# EAGLE schematic schema_v1 (EAGLE 7.7.0)

## Sheet 1 of 2
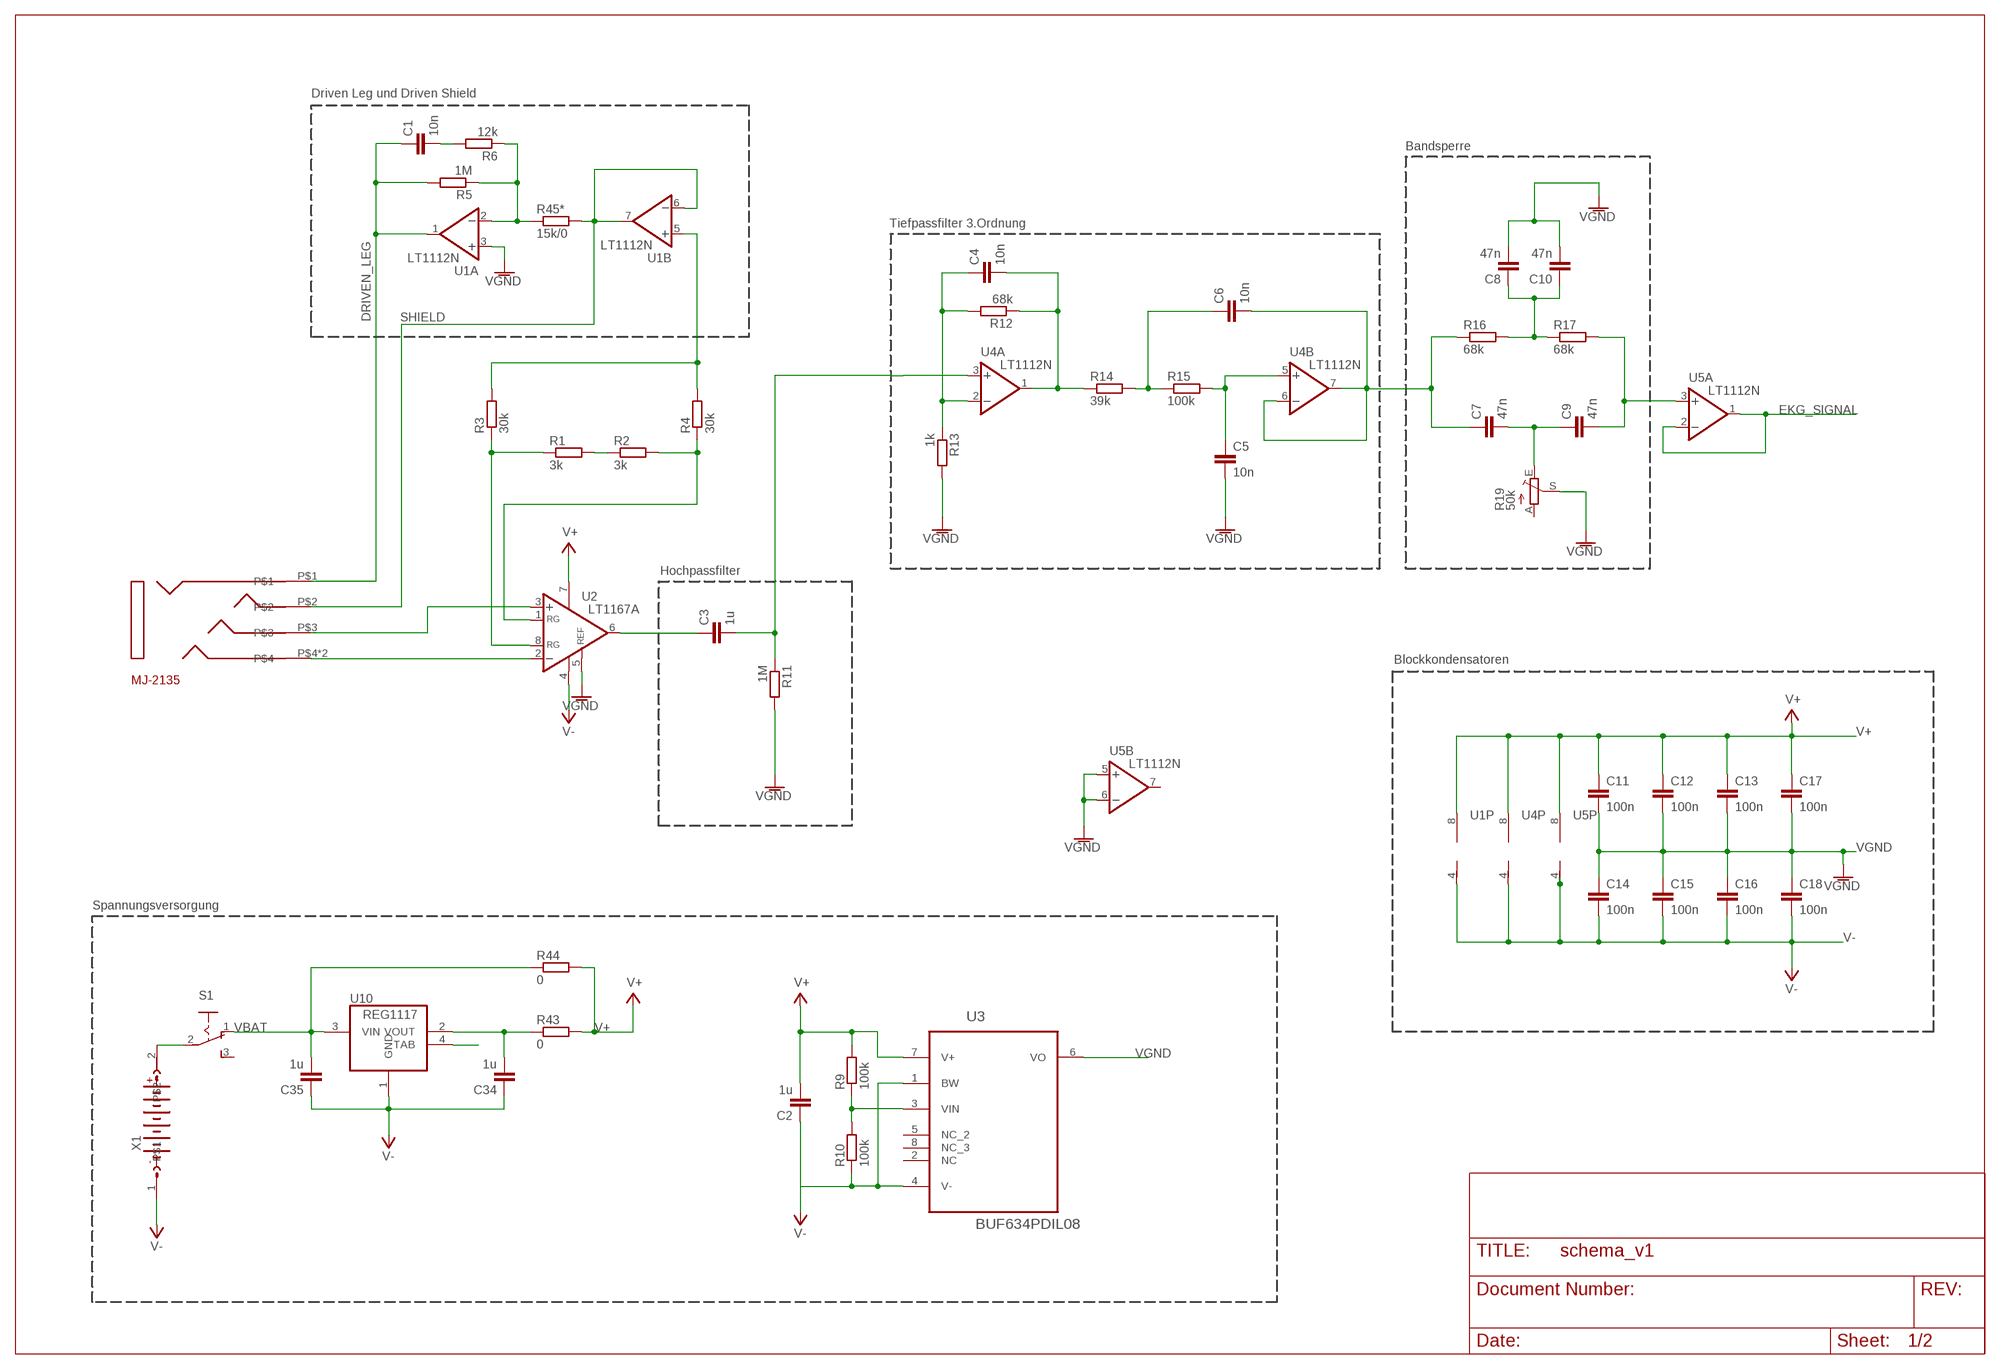
[diagram p0: schematic, sheet 1]

### Parts
C1  10n  C-EUC0805  [C0805]
C2  1u  C-EUC0805  [C0805]
C3  1u  C-EUC0805  [C0805]
C4  10n  C-EUC0805  [C0805]
C5  10n  C-EUC0805  [C0805]
C6  10n  C-EUC0805  [C0805]
C7  47n  C-EUC0805  [C0805]
C8  47n  C-EUC0805  [C0805]
C9  47n  C-EUC0805  [C0805]
C10  47n  C-EUC0805  [C0805]
C11  100n  C-EUC0805  [C0805]
C12  100n  C-EUC0805  [C0805]
C13  100n  C-EUC0805  [C0805]
C14  100n  C-EUC0805  [C0805]
C15  100n  C-EUC0805  [C0805]
C16  100n  C-EUC0805  [C0805]
C17  100n  C-EUC0805  [C0805]
C18  100n  C-EUC0805  [C0805]
C34  1u  C-EUC0805  [C0805]
C35  1u  C-EUC0805  [C0805]
R1  3k  R-EU_M0805  [M0805]
R2  3k  R-EU_M0805  [M0805]
R3  30k  R-EU_M0805  [M0805]
R4  30k  R-EU_M0805  [M0805]
R5  1M  R-EU_M0805  [M0805]
R6  12k  R-EU_M0805  [M0805]
R9  100k  R-EU_M0805  [M0805]
R10  100k  R-EU_M0805  [M0805]
R11  1M  R-EU_M0805  [M0805]
R12  68k  R-EU_M0805  [M0805]
R13  1k  R-EU_M0805  [M0805]
R14  39k  R-EU_M0805  [M0805]
R15  100k  R-EU_M0805  [M0805]
R16  68k  R-EU_M0805  [M0805]
R17  68k  R-EU_M0805  [M0805]
R19  50k  TRIM_EU-B25P  [B25P]
R43  0  R-EU_M0805  [M0805]
R44  0  R-EU_M0805  [M0805]
R45*  15k/0  R-EU_R0805  [R0805]
S1  255SB  [255SB]
U1  LT1112N  [DIL08]
U2  LT1167A  [DIL08]
U3  BUF634PDIL08  [DIL08]
U4  LT1112N  [DIL08]
U5  LT1112N  [DIL08]
U10  REG1117  [SOT223]
X1  BATTERY  [1X02]
X2  MJ2135  [MJ-2135]

### Nets
DRIVEN_LEG: C1.1 R5.2 U1.1(A:OUT) X2.P$1
EKG_SIGNAL: U5.1(A:OUT) U5.2(A:-IN) ; also sheet 2
N$2: C8.1 C10.1 R16.2 R17.1
N$3: R1.2 R2.1
N$5: R5.1 R6.1 R45*.1 U1.2(A:-IN)
N$6: R9.1 R10.2 U3.3(VIN)
N$7: C1.2 R6.2
N$9: U2.2(-IN) X2.P$4 X2.P$5
N$10: U2.3(+IN) X2.P$3
N$12: C3.1 U2.6(OUT)
N$13: C3.2 R11.1 U4.3(A:+IN)
N$14: R2.2 R4.1 U2.1(RG)
N$16: C6.2 C7.1 R16.1 U4.6(B:-IN) U4.7(B:OUT)
N$17: C4.2 R12.1 R14.1 U4.1(A:OUT)
N$18: R3.2 R4.2 U1.5(B:+IN)
N$19: S1.2(P) X1.2
N$20: C6.1 R14.2 R15.1
N$21: C5.1 R15.2 U4.5(B:+IN)
N$23: R1.1 R3.1 U2.8(RG)
N$24: C9.2 R17.2 U5.3(A:+IN)
N$25: C7.2 C9.1 R19.E
N$38: C34.2 R43.1 U10.2(VOUT)
N$39: U10.4(TAB)
N$40: C4.1 R12.2 R13.1 U4.2(A:-IN)
SHIELD: R45*.2 U1.6(B:-IN) U1.7(B:OUT) X2.P$2
V+: C2.2 C11.1 C12.1 C13.1 C17.1 R9.2 R43.2 R44.2 U1.8(P:V+) U2.7(V+) U3.7(V+) U4.8(P:V+) U5.8(P:V+)
V-: C2.1 C14.2 C15.2 C16.2 C18.2 C34.1 C35.1 R10.1 U1.4(P:V-) U2.4(V-) U3.1(BW) U3.4(V-) U4.4(P:V-) U5.4(P:V-) U10.1(GND) X1.1 ; also sheet 2
VBAT: C35.2 R44.1 S1.1(O) U10.3(VIN) ; also sheet 2
VGND: C5.2 C8.2 C10.2 C11.2 C12.2 C13.2 C14.1 C15.1 C16.1 C17.2 C18.1 R11.2 R13.2 R19.S U1.3(A:+IN) U2.5(REF) U3.6(VO) U5.5(B:+IN) U5.6(B:-IN) ; also sheet 2
Unconnected: R19.A S1.3(S) U3.2(NC) U3.5(NC_2) U3.8(NC_3) U5.7(B:OUT)

### Notes on the sheet
- Driven Leg und Driven Shield
- Bandsperre
- Tiefpassfilter 3.Ordnung
- Hochpassfilter
- Blockkondensatoren
- Spannungsversorgung

## Sheet 2 of 2
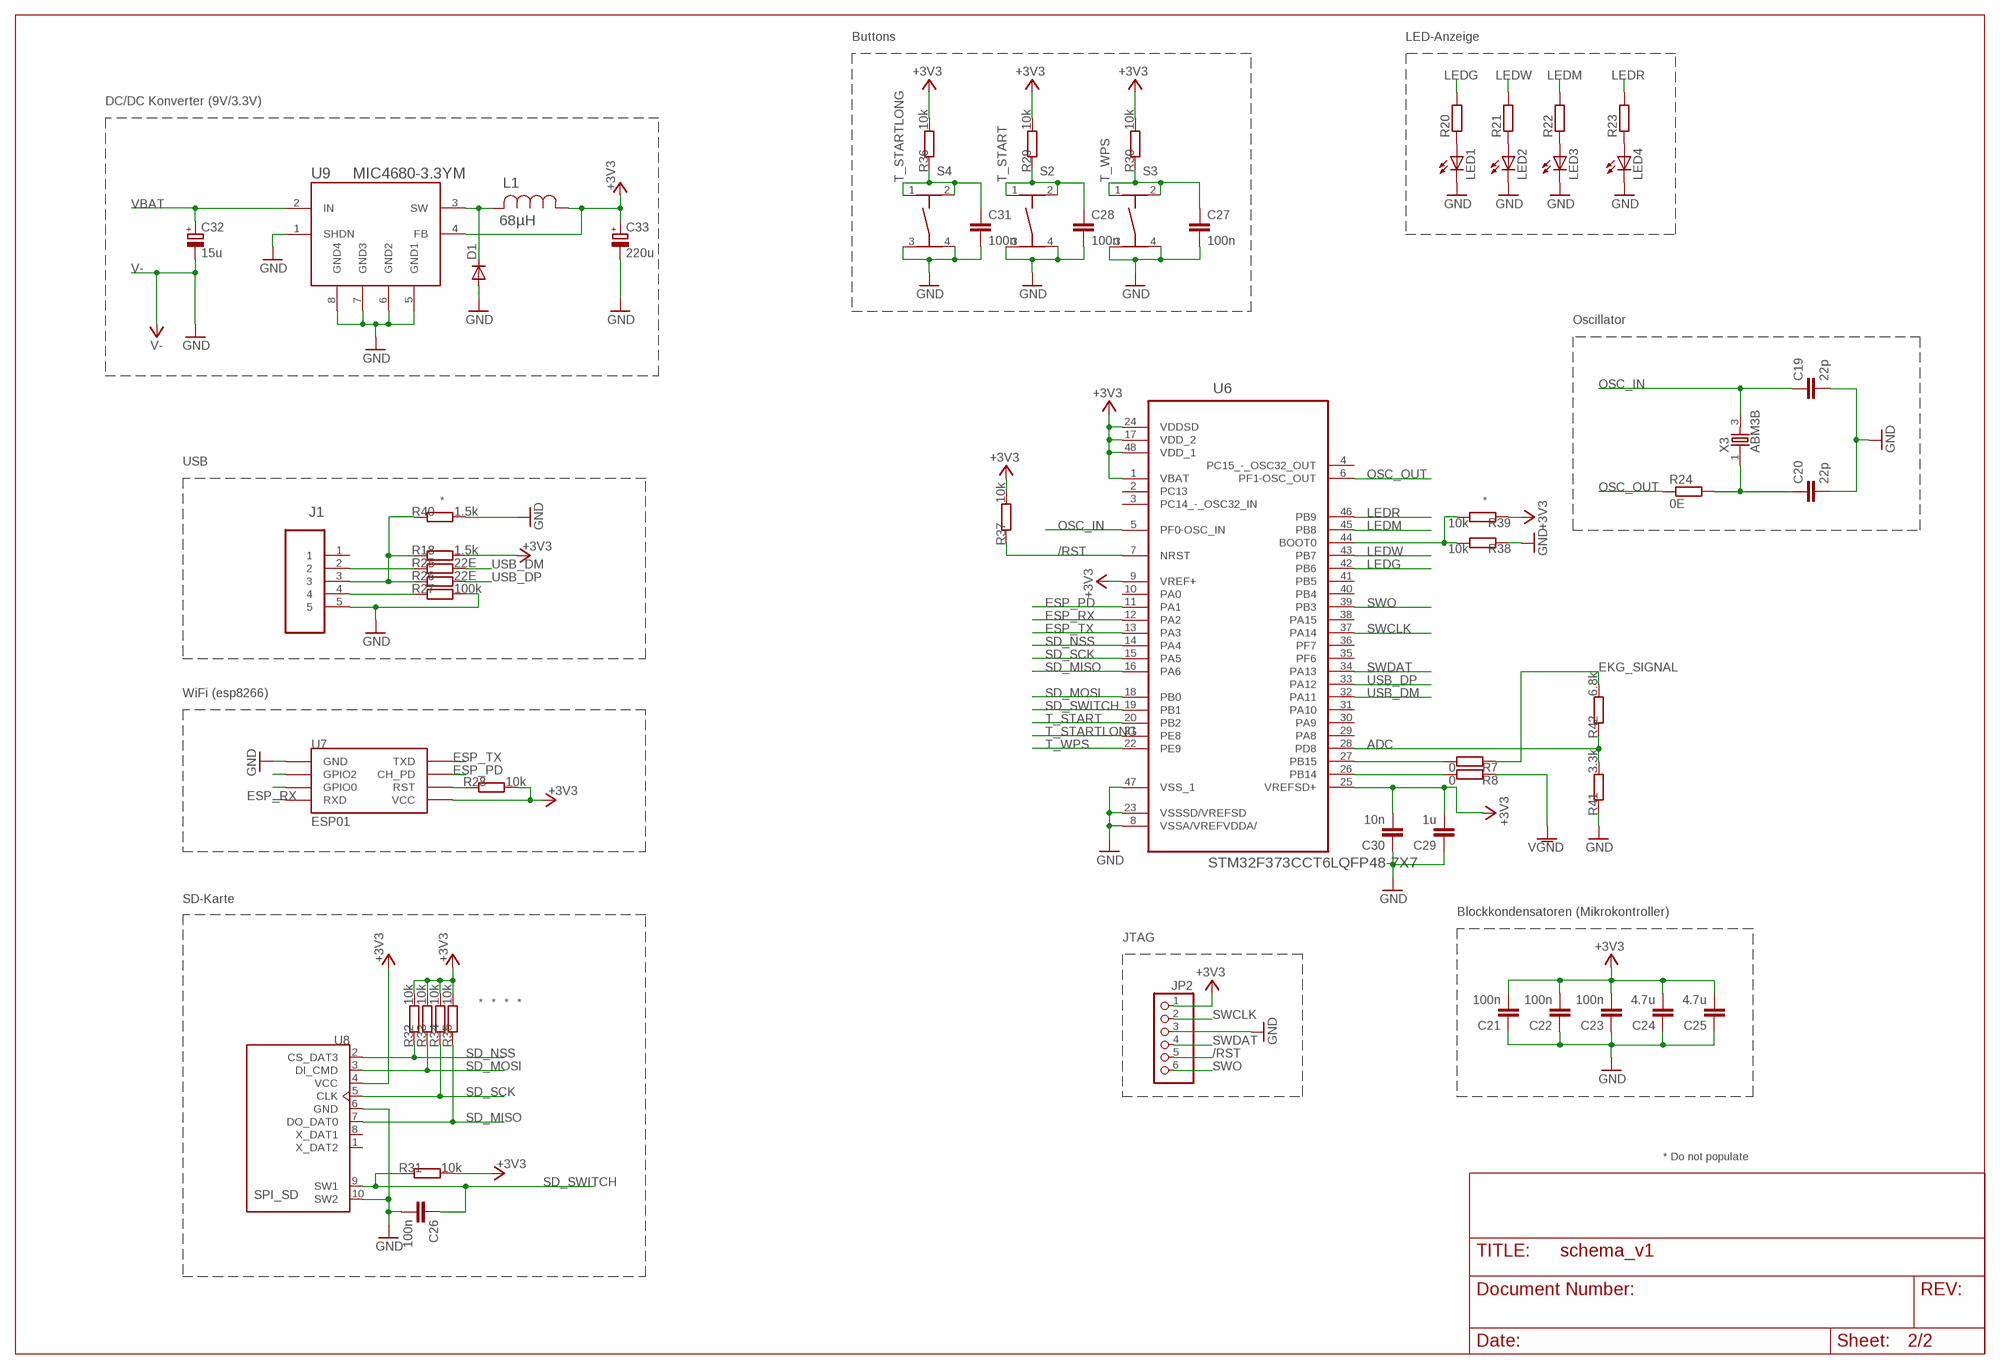
[diagram p1: schematic, sheet 2]

### Parts
C19  22p  C-EUC0805  [C0805]
C20  22p  C-EUC0805  [C0805]
C21  100n  C-EUC0805  [C0805]
C22  100n  C-EUC0805  [C0805]
C23  100n  C-EUC0805  [C0805]
C24  4.7u  C-EUC0805  [C0805]
C25  4.7u  C-EUC0805  [C0805]
C26  100n  C-EUC0805  [C0805]
C27  100n  C-EUC0805  [C0805]
C28  100n  C-EUC0805  [C0805]
C29  1u  C-EUC0805  [C0805]
C30  10n  C-EUC0805  [C0805]
C31  100n  C-EUC0805  [C0805]
C32  15u  CPOL-EUSMCB  [SMC_B]
C33  220u  CPOL-EUSMCE  [SMC_E]
D1  DIODE-DO214AC  [DO214AC]
J1  47346-0001  [MOLEX_47346-0001]
JP2  PINHD-1X6  [1X06]
L1  68µH  UP2B-680-R  [INDM1410X600N]
LED1  LED3MM  [LED3MM]
LED2  LED3MM  [LED3MM]
LED3  LED3MM  [LED3MM]
LED4  LED3MM  [LED3MM]
R7  0  R-EU_R0805  [R0805]
R8  0  R-EU_R0805  [R0805]
R18  1.5k  R-EU_R0805  [R0805]
R20  R-EU_R0805  [R0805]
R21  R-EU_R0805  [R0805]
R22  R-EU_R0805  [R0805]
R23  R-EU_R0805  [R0805]
R24  0E  R-EU_R0805  [R0805]
R25  22E  R-EU_R0805  [R0805]
R26  22E  R-EU_R0805  [R0805]
R27  100k  R-EU_R0805  [R0805]
R28  10k  R-EU_R0805  [R0805]
R29  10k  R-EU_R0805  [R0805]
R30  10k  R-EU_R0805  [R0805]
R31  10k  R-EU_R0805  [R0805]
R32  10k  R-EU_R0805  [R0805]
R33  10k  R-EU_R0805  [R0805]
R34  10k  R-EU_R0805  [R0805]
R35  10k  R-EU_R0805  [R0805]
R36  10k  R-EU_R0805  [R0805]
R37  10k  R-EU_R0805  [R0805]
R38  10k  R-EU_R0805  [R0805]
R39  10k  R-EU_R0805  [R0805]
R40  1.5k  R-EU_R0805  [R0805]
R41  3.3k  R-EU_R0805  [R0805]
R42  6.8k  R-EU_R0805  [R0805]
S2  TASTER-9314_SMD  [TASTER-9314_SMD]
S3  TASTER-9314_SMD  [TASTER-9314_SMD]
S4  TASTER-9314_SMD  [TASTER-9314_SMD]
U6  STM32F373CCT6LQFP48-7X7  [LQFP48-7X7]
U7  ESP01  [ESP01]
U8  MICROSD  [SD-503398-003]
U9  MIC4680-3.3YM  [SOIC8]
X3  ABM3B  [IQG5032B]

### Nets
+3V3: C21.2 C22.2 C23.2 C24.2 C25.2 C29.2 C30.2 C33.+ JP2.1 L1.1 R18.2 R28.2 R29.2 R30.2 R31.2 R32.2 R33.2 R34.2 R35.2 R36.2 R37.2 R39.1 U6.1(VBAT) U6.9(VREF+) U6.17(VDD_2) U6.24(VDDSD) U6.25(VREFSD+) U6.48(VDD_1) U7.VCC U8.4(VCC) U9.4(FB)
/RST: JP2.5 R37.1 U6.7(NRST)
ADC: R41.2 R42.1 U6.28(PD8)
EKG_SIGNAL: R7.1 R42.2 ; also sheet 1
ESP_PD: U6.11(PA1) U7.CH_PD
ESP_RX: U6.12(PA2) U7.RX(RXD)
ESP_TX: U6.13(PA3) U7.TX(TXD)
LEDG: R20.2 U6.42(PB6)
LEDM: R22.2 U6.45(PB8)
LEDR: R23.2 U6.46(PB9)
LEDW: R21.2 U6.43(PB7)
N$4: R7.2 U6.27(PB15)
N$8: R8.2 U6.26(PB14)
N$11: LED1.A R20.1
N$15: LED2.A R21.1
N$22: LED3.A R22.1
N$26: LED4.A R23.1
N$27: J1.4 R27.1
N$28: J1.3 R18.1 R26.1 R40.1
N$29: J1.2 R25.1
N$30: R28.1 U7.RST
N$31: U7.GPIO2
N$32: U7.GPIO0
N$33: C20.1 R24.2 X3.1
N$35: R38.2 R39.2 U6.44(BOOT0)
N$36: D1.C L1.2 U9.3(SW)
OSC_IN: C19.1 U6.5(PF0-OSC_IN) X3.3
OSC_OUT: R24.1 U6.6(PF1-OSC_OUT)
SD_MISO: R35.1 U6.16(PA6) U8.7(DO_DAT0)
SD_MOSI: R33.1 U6.18(PB0) U8.3(DI_CMD)
SD_NSS: R32.1 U6.14(PA4) U8.2(CS_DAT3)
SD_SCK: R34.1 U6.15(PA5) U8.5(CLK)
SD_SWITCH: C26.1 R31.1 U6.19(PB1) U8.9(SW1)
SWCLK: JP2.2 U6.37(PA14)
SWDAT: JP2.4 U6.34(PA13)
SWO: JP2.6 U6.39(PB3)
T_START: C28.1 R29.1 S2.1 S2.2 U6.20(PB2)
T_STARTLONG: C31.1 R36.1 S4.1 S4.2 U6.21(PE8)
T_WPS: C27.1 R30.1 S3.1 S3.2 U6.22(PE9)
USB_DM: R25.2 U6.32(PA11)
USB_DP: R26.2 U6.33(PA12)
V-: C19.2 C20.2 C21.1 C22.1 C23.1 C24.1 C25.1 C26.2 C27.2 C28.2 C29.1 C30.1 C31.2 C32.- C33.- D1.A J1.5 JP2.3 LED1.K(C) LED2.K(C) LED3.K(C) LED4.K(C) R27.2 R38.1 R40.2 R41.1 S2.3 S2.4 S3.3 S3.4 S4.3 S4.4 U6.8(VSSA/VREFVDDA/) U6.23(VSSSD/VREFSD) U6.47(VSS_1) U7.GND U8.6(GND) U8.10(SW2) U9.1(SHDN) U9.5(GND1) U9.6(GND2) U9.7(GND3) U9.8(GND4) ; supply symbol labelled GND ; also sheet 1
VBAT: C32.+ U9.2(IN) ; also sheet 1
VGND: R8.1 ; also sheet 1
Unconnected: J1.1 U6.2(PC13) U6.3(PC14_-_OSC32_IN) U6.4(PC15_-_OSC32_OUT) U6.10(PA0) U6.29(PA8) U6.30(PA9) U6.31(PA10) U6.35(PF6) U6.36(PF7) U6.38(PA15) U6.40(PB4) U6.41(PB5) U8.1(X_DAT2) U8.8(X_DAT1)

### Notes on the sheet
- Buttons | LED-Anzeige
- DC/DC Konverter (9V/3.3V)
- Oscillator
- USB
- * | *
- WiFi (esp8266)
- SD-Karte
- Blockkondensatoren (Mikrokontroller)
- JTAG
- * | * | * | *
- * Do not populate

## Library data of the parts
C1-C31 C34 C35 = resistor:C-EU: CAPACITOR, European symbol
C32 C33 = rcl:CPOL-EU: POLARIZED CAPACITOR, European symbol
D1 = diode:DIODE-: DIODE
J1 = pro3E:47346-0001: CONN RCPT 5POS MICRO USB R/A SMD; MPN: 47346-0001; OC_FARNELL: 1568026; OC_NEWARK: 47M0505; PACKAGE: 5 POS MICRO USB R/A; SUPPLIER: MOLEX
JP2 = pinhead:PINHD-1X6: PIN HEADER
L1 = pro3E:UP2B-680-R: POWER INDUCTOR; CURRENTRATING: 1.5A; MPN: UP2B-680-R; OC_FARNELL: 1463537; OC_NEWARK: 29K6281; PACKAGE: SMD; SUPPLIER: Coiltronics; TOLERANCE: ±20%
LED1-LED4 = led:LED: LED OSRAM: - CHIPLED LG R971, LG N971, LY N971, LG Q971, LY Q971, LO R971, LY R971 LH N974, LH R974 LS Q976, LO Q976, LY Q976 LO Q996 - Hyper CHIPLED LW Q18S LB Q993, LB Q99A, LB R99A - SideLED LS A670, LO A670, LY A670, LG A670, LP A670 LB A673, LV A673, LT A673, LW A673 LH A674 LY A675 LS A676, LA A676, LO A676, LY A676, LW A676 LS A679, LY A679, LG A679 - Hyper Micro SIDELED® LS Y876, LA Y876, LO Y876, LY Y876 LT Y87S - SmartLED LW L88C, LW L88S LB L89C, LB L89S, LG L890 LS L89K, LO L89K, LY L89K LS L896, LA L896, LO L896, LY L896 - TOPLED LS T670, LO T670, LY T670, LG T670, LP T670 LSG T670, LSP T670, LSY T670, LOP T670, LYG T670 LG T671, LOG T671, LSG T671 LB T673, LV T673, LT T673, LW T673 LH T674 LS T676, LA T676, LO T676, LY T676, LB T676, LH T676, LSB T676, LW T676 LB T67C, LV T67C, LT T67C, LS T67K, LO T67K, LY T67K, LW E67C LS E67B, LA E67B, LO E67B, LY E67B, LB E67C, LV E67C, LT E67C LW T67C LS T679, LY T679, LG T679 LS T770, LO T770, LY T770, LG T770, LP T770 LB T773, LV T773, LT T773, LW T773 LH T774 LS E675, LA E675, LY E675, LS T675 LS T776, LA T776, LO T776, LY T776, LB T776 LHGB T686 LT T68C, LB T68C - Hyper Mini TOPLED® LB M676 - Mini TOPLED Santana® LG M470 LS M47K, LO M47K, LY M47K Source: http://www.osram.convergy.de LUXEON: - LUMILED® LXK2-PW12-R00, LXK2-PW12-S00, LXK2-PW14-U00, LXK2-PW14-V00 LXK2-PM12-R00, LXK2-PM12-S00, LXK2-PM14-U00 LXK2-PE12-Q00, LXK2-PE12-R00, LXK2-PE12-S00, LXK2-PE14-T00, LXK2-PE14-U00 LXK2-PB12-K00, LXK2-PB12-L00, LXK2-PB12-M00, LXK2-PB14-N00, LXK2-PB14-P00, LXK2-PB14-Q00 LXK2-PR12-L00, LXK2-PR12-M00, LXK2-PR14-Q00, LXK2-PR14-R00 LXK2-PD12-Q00, LXK2-PD12-R00, LXK2-PD12-S00 LXK2-PH12-R00, LXK2-PH12-S00 LXK2-PL12-P00, LXK2-PL12-Q00, LXK2-PL12-R00 Source: www.luxeon.com KINGBRIGHT: KA-3528ASYC Source: www.kingbright.com
R1-R18 R20-R44 R45* = resistor:R-EU_: RESISTOR, European symbol
R19 = pot:TRIM_EU-: POTENTIOMETER
S1 = switch:255SB: SLIDING SWITCH Distributor Buerklin, 11G810
S2-S4 = pro3E:TASTER-9314_SMD
U1 U4 U5 = pro3E:LT1112
U2 = pro3E:LT1167
U3 = pro3E:BUF634P: BUFFER AMPLIFIER
U6 = pro3E:STM32F373CCT6: MCU, 32BIT, CORTEX M4, 48LQFP
U7 = esp8266modules:ESP01: ESP8266 Wifi module 01
U8 = pro3E:MICROSD
U9 = pro3E:MIC4680-3.3YM; MF: MICROCHIP; MPN: MIC4680-3.3YM; OC_FARNELL: 2510172; OC_NEWARK: MIC4680-3.3YM
U10 = pro3E:REG1117: 800mA and 1A Low Dropout (LDO) Positive Regulator 1.8V, 2.5V, 2.85V, 3.3V, 5V, and Adj; MPN: REG1117; OC_FARNELL: 1097566; OC_NEWARK: 14P6981
X1 = pro3E:BATTERY: Battery
X2 = pro3E:MJ2135: 4 Polige 3.5mm Jack Buchse
X3 = pro3E:ABM3B